# Altium schematic sheet LED_RGB_SMDx2.SCHDOC: Visual Indicators
size A4; DocumentNumber: 1; SheetNumber: 2; SheetTotal: 77
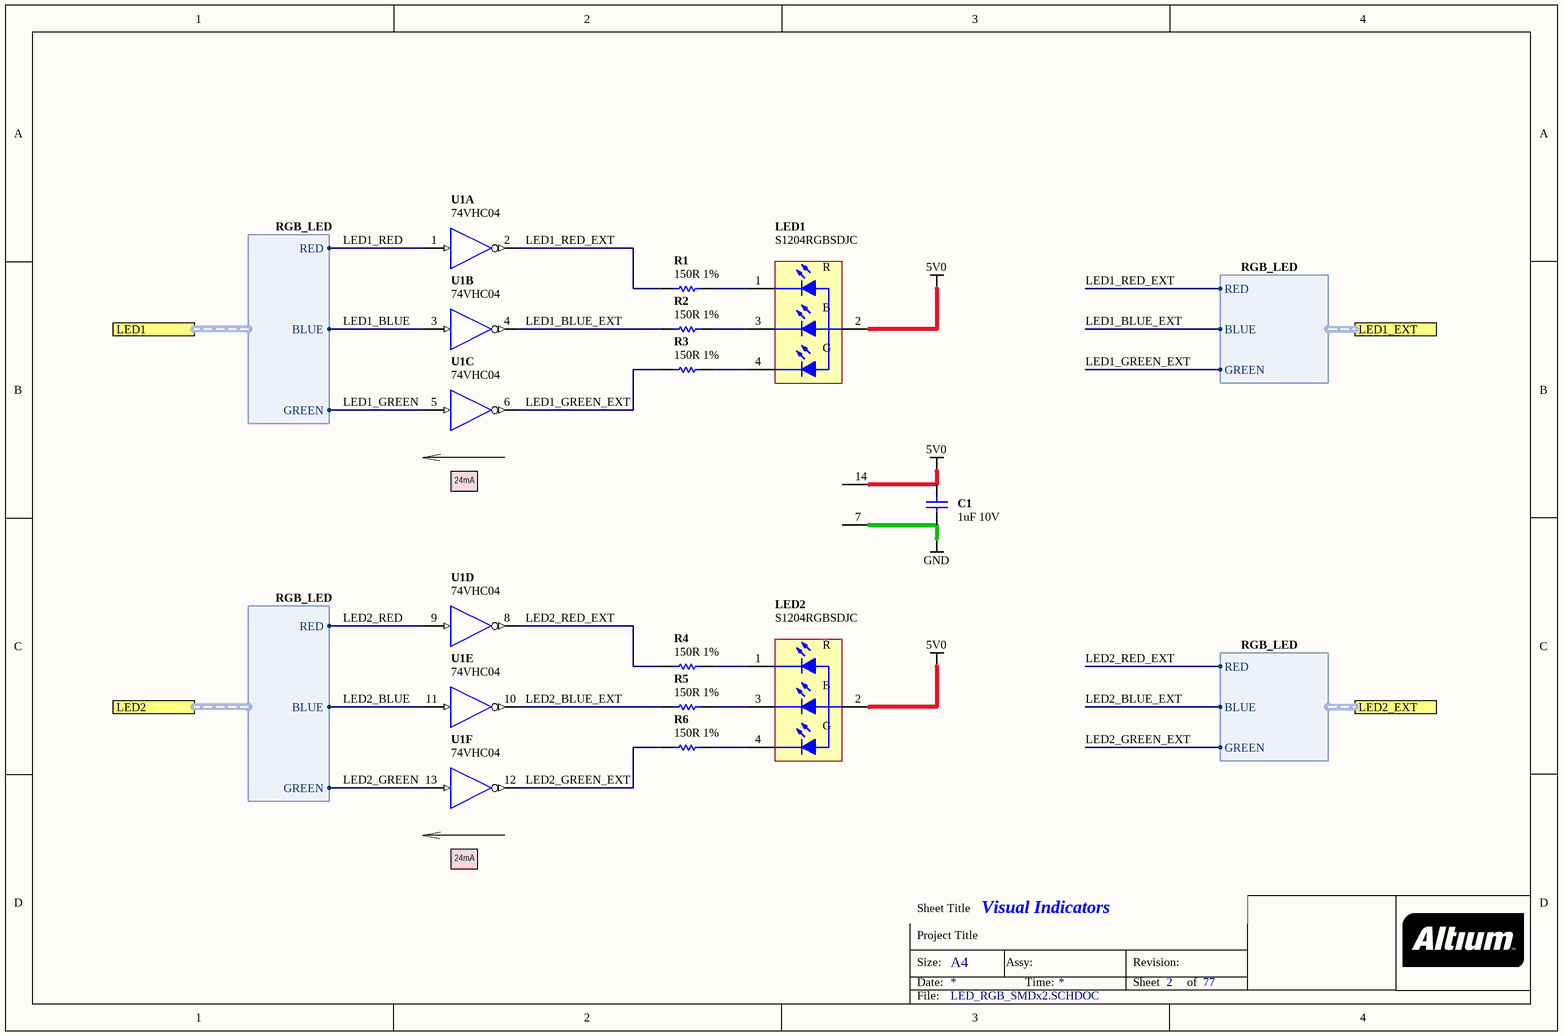
[diagram p0: LED_RGB_SMDx2.SCHDOC]

## Parts
C1  1uF 10V  [CAPC1005-STAR]
LED1  S1204RGBSDJC  [S1204RGBSDJC]
LED2  S1204RGBSDJC  [S1204RGBSDJC]
R1  150R 1%  [RESC1005-STAR]
R2  150R 1%  [RESC1005-STAR]
R3  150R 1%  [RESC1005-STAR]
R4  150R 1%  [RESC1005-STAR]
R5  150R 1%  [RESC1005-STAR]
R6  150R 1%  [RESC1005-STAR]
U1  74VHC04  [TSSOP14]  (parts A,B,C,D,E,F of 6)

## Ports
LED1 (harness RGB_LED), LED1_EXT (harness RGB_LED), LED2 (harness RGB_LED), LED2_EXT (harness RGB_LED)

## Harnesses
RGB_LED: GREEN, RED, BLUE

## Nets
5V0: C1.2 LED1.2(A2) LED2.2(A2) U1.14(VCC)
GND: C1.1 U1.7(GND)
LED1_BLUE: U1.3(A) ; port LED1.BLUE
LED1_BLUE_EXT: R2.2 U1.4(Y) ; port LED1_EXT.BLUE
LED1_GREEN: U1.5(A) ; port LED1.GREEN
LED1_GREEN_EXT: R3.2 U1.6(Y) ; port LED1_EXT.GREEN
LED1_RED: U1.1(A) ; port LED1.RED
LED1_RED_EXT: R1.2 U1.2(Y) ; port LED1_EXT.RED
LED2_BLUE: U1.11(A) ; port LED2.BLUE
LED2_BLUE_EXT: R5.2 U1.10(Y) ; port LED2_EXT.BLUE
LED2_GREEN: U1.13(A) ; port LED2.GREEN
LED2_GREEN_EXT: R6.2 U1.12(Y) ; port LED2_EXT.GREEN
LED2_RED: U1.9(A) ; port LED2.RED
LED2_RED_EXT: R4.2 U1.8(Y) ; port LED2_EXT.RED
NetLED1_1: LED1.1(R) R1.1
NetLED1_3: LED1.3(B) R2.1
NetLED1_4: LED1.4(G) R3.1
NetLED2_1: LED2.1(R) R4.1
NetLED2_3: LED2.3(B) R5.1
NetLED2_4: LED2.4(G) R6.1

## Notes on the sheet
- (near U1) 24mA
- 24mA
- Sheet Title
- Project Title
- Size:
- Date:
- A4
- Assy:
- Time:
- Revision:
- Sheet
- of
- File:

## Library data of the parts
C1 = D-101-0131: Capacitor, Ceramic, 1uF 10% 10V 0402 (1005) X5R; Polarity: Non-Polarized; Category: Capacitor; Capacitance: 1 uF; Dielectric: X5R; Mounting Technology: Surface Mount; Rated Voltage: 10 V; Status: Unreleased; Technology: None; Tolerance: 10 %
LED1 LED2 = D-153-0020: SASEN LED, RGB, SMD; Brightness: mcd; Peak Wave Length: nm; Color: RGB; Mounting Technology: Surface Mount; Status: Production; Category: LED
R1-R6 = D-100-0005: Resistor, 150R 1% 0402 (1005); Power Rating: 63 mW; Category: Resistor; Mounting Technology: Surface Mount; Resistance: 150 R; Status: Unreleased; Tolerance: 1 %
U1 = D-205-0004: HEX Inverter; Mounting Technology: Surface Mount; Status: Unreleased; Category: IC-Logic